# EAGLE schematic Inverted F (EAGLE 9.1.2)
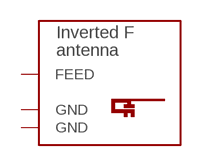
[diagram p0: schematic, sheet 1]

## Parts
U$1  INVERTED_F_ANTENNA+0  [DN007+0]
Unconnected: U$1.FEED U$1.GND U$1.GND@1(GND)

## Library data of the parts
U$1 = antenna:INVERTED_F_ANTENNA: 2.4GHz Inverted F Antenna Based on TI Design Note DN007